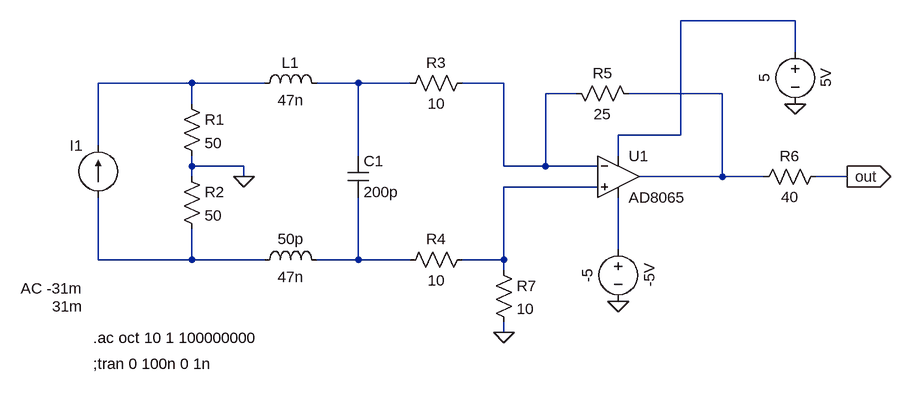
[diagram p0: schematic DAC.asc]
DAC.asc, the LTspice schematic file:
Version 4
SHEET 1 1392 680
WIRE 960 -112 784 -112
WIRE 960 -64 960 -112
WIRE 32 -16 -112 -16
WIRE 144 -16 32 -16
WIRE 288 -16 224 -16
WIRE 368 -16 288 -16
WIRE 512 -16 448 -16
WIRE 624 0 576 0
WIRE 848 0 704 0
WIRE 32 16 32 -16
WIRE 784 64 784 -112
WIRE 784 64 688 64
WIRE -112 80 -112 -16
WIRE 288 96 288 -16
WIRE 688 96 688 64
WIRE 32 112 32 96
WIRE 112 112 32 112
WIRE 512 112 512 -16
WIRE 576 112 576 0
WIRE 576 112 512 112
WIRE 656 112 576 112
WIRE 32 128 32 112
WIRE 112 128 112 112
WIRE 848 128 848 0
WIRE 848 128 720 128
WIRE 912 128 848 128
WIRE 1040 128 992 128
WIRE 656 144 512 144
WIRE 688 240 688 160
WIRE -112 256 -112 160
WIRE 32 256 32 208
WIRE 32 256 -112 256
WIRE 144 256 32 256
WIRE 288 256 288 160
WIRE 288 256 224 256
WIRE 368 256 288 256
WIRE 512 256 512 144
WIRE 512 256 448 256
WIRE 512 272 512 256
WIRE 512 368 512 352
FLAG 688 320 0
FLAG 112 128 0
FLAG 960 16 0
FLAG 1040 128 out
IOPIN 1040 128 Out
FLAG 512 368 0
SYMBOL ind 128 0 R270
WINDOW 0 32 56 VTop 2
WINDOW 3 5 56 VBottom 2
SYMATTR InstName L1
SYMATTR Value 47n
SYMBOL cap 272 96 R0
SYMATTR InstName C1
SYMATTR Value 200p
SYMBOL ind 128 272 R270
WINDOW 0 32 56 VTop 2
WINDOW 3 5 56 VBottom 2
SYMATTR InstName 50p
SYMATTR Value 47n
SYMBOL res 16 0 R0
SYMATTR InstName R1
SYMATTR Value 50
SYMBOL res 16 112 R0
SYMATTR InstName R2
SYMATTR Value 50
SYMBOL res 464 -32 R90
WINDOW 0 0 56 VBottom 2
WINDOW 3 32 56 VTop 2
SYMATTR InstName R3
SYMATTR Value 10
SYMBOL res 464 240 R90
WINDOW 0 0 56 VBottom 2
WINDOW 3 32 56 VTop 2
SYMATTR InstName R4
SYMATTR Value 10
SYMBOL res 608 -16 M90
WINDOW 0 0 56 VBottom 2
WINDOW 3 32 56 VTop 2
SYMATTR InstName R5
SYMATTR Value 25
SYMBOL voltage 960 -80 R0
WINDOW 0 32 56 VTop 2
WINDOW 3 -32 56 VBottom 2
WINDOW 123 0 0 Left 0
WINDOW 39 0 0 Left 0
SYMATTR InstName 5V
SYMATTR Value 5
SYMBOL voltage 688 224 R0
WINDOW 0 32 56 VTop 2
WINDOW 3 -32 56 VBottom 2
WINDOW 123 0 0 Left 0
WINDOW 39 0 0 Left 0
SYMATTR InstName -5V
SYMATTR Value -5
SYMBOL res 1008 112 R90
WINDOW 0 0 56 VBottom 2
WINDOW 3 32 56 VTop 2
SYMATTR InstName R6
SYMATTR Value 40
SYMBOL current -112 160 R180
WINDOW 0 24 80 Left 2
WINDOW 3 24 -168 Left 2
WINDOW 123 24 -140 Left 2
WINDOW 39 0 0 Left 0
SYMATTR InstName I1
SYMATTR Value 31m
SYMATTR Value2 AC -31m
SYMBOL res 496 256 R0
SYMATTR InstName R7
SYMATTR Value 10
SYMBOL OpAmps\\AD8065 688 64 R0
SYMATTR InstName U1
TEXT -120 376 Left 2 !.ac oct 10 1 100000000
TEXT -120 416 Left 2 !;tran 0 100n 0 1n

The netlist it stands for:
* DAC.asc
L1 N002 N003 47n
C1 N003 N009 200p
L§50p N008 N009 47n
R1 N002 0 50
R2 0 N008 50
R3 N004 N003 10
R4 N006 N009 10
R5 N004 N005 25
V§5V N001 0 5
V§-5V N007 0 -5
R6 out N005 40
I1 N008 N002 31m AC -31m
R7 N006 0 10
XU1 N006 N004 N001 N007 N005 AD8065  ; pins In+ In- V+ V- OUT
.ac oct 10 1 100000000
;tran 0 100n 0 1n
.backanno
.end